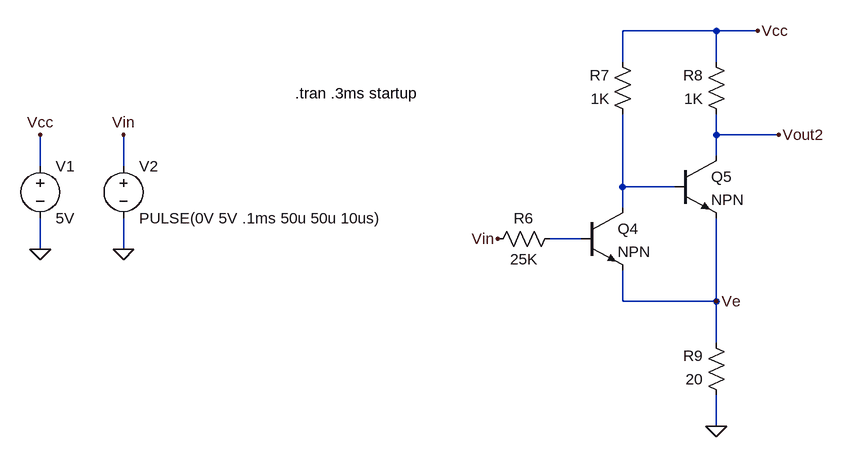
[diagram p0: schematic figure-2.13-bjt-schmitt-trigger.asc]
figure-2.13-bjt-schmitt-trigger.asc, the LTspice schematic file:
Version 4
SHEET 1 1240 680
WIRE 960 -96 816 -96
WIRE 1024 -96 960 -96
WIRE 816 -48 816 -96
WIRE 960 -48 960 -96
WIRE 960 64 960 32
WIRE 1056 64 960 64
WIRE 960 96 960 64
WIRE -80 112 -80 64
WIRE 48 112 48 64
WIRE 816 144 816 32
WIRE 896 144 816 144
WIRE 816 176 816 144
WIRE 752 224 704 224
WIRE -80 240 -80 192
WIRE 48 240 48 192
WIRE 816 320 816 272
WIRE 960 320 960 192
WIRE 960 320 816 320
WIRE 960 384 960 320
WIRE 960 512 960 464
FLAG 1024 -96 Vcc
FLAG 1056 64 Vout2
FLAG -80 240 0
FLAG 48 240 0
FLAG 48 64 Vin
FLAG -80 64 Vcc
FLAG 960 512 0
FLAG 960 320 Ve
FLAG 624 224 Vin
SYMBOL voltage -80 96 R0
WINDOW 123 0 0 Left 0
WINDOW 39 0 0 Left 0
SYMATTR InstName V1
SYMATTR Value 5V
SYMBOL voltage 48 96 R0
WINDOW 123 0 0 Left 0
WINDOW 39 0 0 Left 0
SYMATTR InstName V2
SYMATTR Value PULSE(0V 5V .1ms 50u 50u 10us)
SYMBOL npn 752 176 R0
SYMATTR InstName Q4
SYMBOL npn 896 96 R0
SYMATTR InstName Q5
SYMBOL res 720 208 R90
WINDOW 0 0 56 VBottom 2
WINDOW 3 32 56 VTop 2
SYMATTR InstName R6
SYMATTR Value 25K
SYMBOL res 832 48 R180
WINDOW 0 36 76 Left 2
WINDOW 3 36 40 Left 2
SYMATTR InstName R7
SYMATTR Value 1K
SYMBOL res 976 48 R180
WINDOW 0 36 76 Left 2
WINDOW 3 36 40 Left 2
SYMATTR InstName R8
SYMATTR Value 1K
SYMBOL res 976 480 R180
WINDOW 0 36 76 Left 2
WINDOW 3 36 40 Left 2
SYMATTR InstName R9
SYMATTR Value 20
TEXT 312 0 Left 2 !.tran .3ms startup

The netlist it stands for:
* figure-2.13-bjt-schmitt-trigger.asc
V1 Vcc 0 5V
V2 Vin 0 PULSE(0V 5V .1ms 50u 50u 10us)
Q4 N001 N002 Ve 0 NPN
Q5 Vout2 N001 Ve 0 NPN
R6 N002 Vin 25K
R7 N001 Vcc 1K
R8 Vout2 Vcc 1K
R9 0 Ve 20
.model NPN NPN
.model PNP PNP
.lib standard.bjt
.tran .3ms startup
.backanno
.end

* Results of the author's LTspice run, read from the files saved beside the schematic
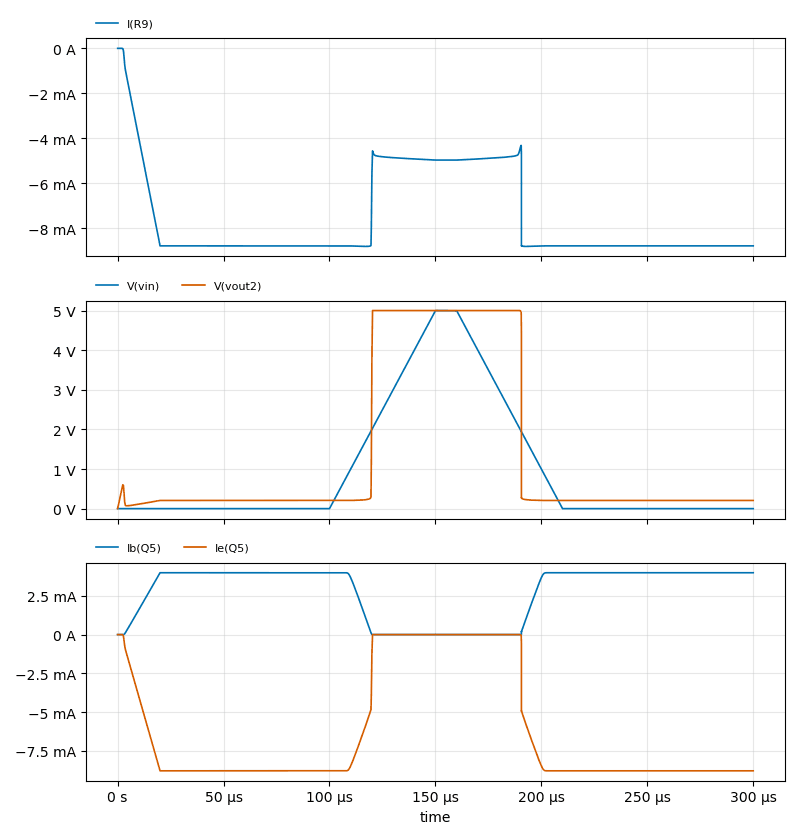
[diagram p1: Transient Analysis of figure-2.13-bjt-schmitt-trigger.asc, plotted from the saved traces]
* Transient Analysis, 1 run:
*   I(R9): min -8.804 mA, max 0 A, average -7.544 mA, rms 7.813 mA, last -8.779 mA
*   V(vin): min 0 V, max 5 V, average 999.9 mV, rms 1.905 V, last 0 V
*   V(vout2): min 0 V, max 5 V, average 1.334 V, rms 2.432 V, last 206 mV
*   Ib(Q5): min 0 A, max 3.985 mA, average 2.757 mA, rms 3.267 mA, last 3.985 mA
*   Ie(Q5): min -8.779 mA, max 0 A, average -6.257 mA, rms 7.307 mA, last -8.779 mA